# Altium schematic sheet Sheet2.SchDoc
size A4
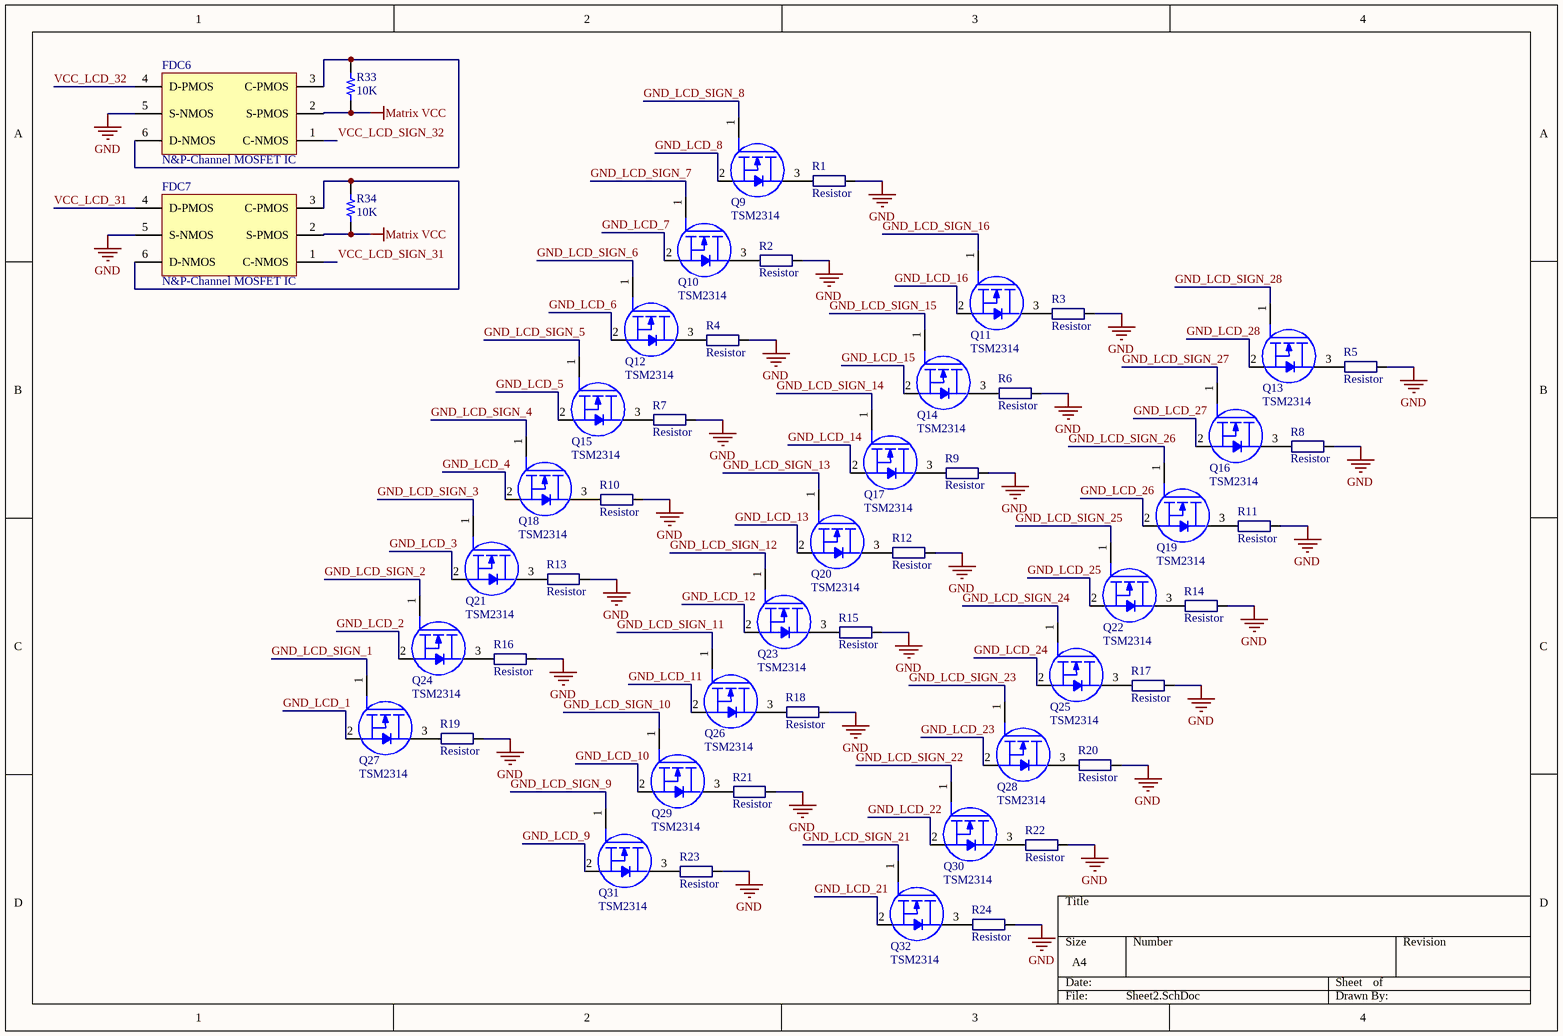
[diagram p0: Sheet2.SchDoc]

## Parts
FDC6  N&P-Channel MOSFET IC  [SSOT-6]
FDC7  N&P-Channel MOSFET IC  [SSOT-6]
Q9  TSM2314  [SOT95P280X130-3N]
Q10  TSM2314  [SOT95P280X130-3N]
Q11  TSM2314  [SOT95P280X130-3N]
Q12  TSM2314  [SOT95P280X130-3N]
Q13  TSM2314  [SOT95P280X130-3N]
Q14  TSM2314  [SOT95P280X130-3N]
Q15  TSM2314  [SOT95P280X130-3N]
Q16  TSM2314  [SOT95P280X130-3N]
Q17  TSM2314  [SOT95P280X130-3N]
Q18  TSM2314  [SOT95P280X130-3N]
Q19  TSM2314  [SOT95P280X130-3N]
Q20  TSM2314  [SOT95P280X130-3N]
Q21  TSM2314  [SOT95P280X130-3N]
Q22  TSM2314  [SOT95P280X130-3N]
Q23  TSM2314  [SOT95P280X130-3N]
Q24  TSM2314  [SOT95P280X130-3N]
Q25  TSM2314  [SOT95P280X130-3N]
Q26  TSM2314  [SOT95P280X130-3N]
Q27  TSM2314  [SOT95P280X130-3N]
Q28  TSM2314  [SOT95P280X130-3N]
Q29  TSM2314  [SOT95P280X130-3N]
Q30  TSM2314  [SOT95P280X130-3N]
Q31  TSM2314  [SOT95P280X130-3N]
Q32  TSM2314  [SOT95P280X130-3N]
R1  Resistor  [RESC0603(1608)_N]
R2  Resistor  [RESC0603(1608)_N]
R3  Resistor  [RESC0603(1608)_N]
R4  Resistor  [RESC0603(1608)_N]
R5  Resistor  [RESC0603(1608)_N]
R6  Resistor  [RESC0603(1608)_N]
R7  Resistor  [RESC0603(1608)_N]
R8  Resistor  [RESC0603(1608)_N]
R9  Resistor  [RESC0603(1608)_N]
R10  Resistor  [RESC0603(1608)_N]
R11  Resistor  [RESC0603(1608)_N]
R12  Resistor  [RESC0603(1608)_N]
R13  Resistor  [RESC0603(1608)_N]
R14  Resistor  [RESC0603(1608)_N]
R15  Resistor  [RESC0603(1608)_N]
R16  Resistor  [RESC0603(1608)_N]
R17  Resistor  [RESC0603(1608)_N]
R18  Resistor  [RESC0603(1608)_N]
R19  Resistor  [RESC0603(1608)_N]
R20  Resistor  [RESC0603(1608)_N]
R21  Resistor  [RESC0603(1608)_N]
R22  Resistor  [RESC0603(1608)_N]
R23  Resistor  [RESC0603(1608)_N]
R24  Resistor  [RESC0603(1608)_N]
R33  10K  [RES 0603/1608]
R34  10K  [RES 0603/1608]

## Nets
GND: FDC6.5(S-NMOS) FDC7.5(S-NMOS) R1.2 R2.2 R3.2 R4.2 R5.2 R6.2 R7.2 R8.2 R9.2 R10.2 R11.2 R12.2 R13.2 R14.2 R15.2 R16.2 R17.2 R18.2 R19.2 R20.2 R21.2 R22.2 R23.2 R24.2
Matrix VCC: FDC6.2(S-PMOS) FDC7.2(S-PMOS) R33.1 R34.1
GND_LCD_1: Q27.2(Source)
GND_LCD_2: Q24.2(Source)
GND_LCD_3: Q21.2(Source)
GND_LCD_4: Q18.2(Source)
GND_LCD_5: Q15.2(Source)
GND_LCD_6: Q12.2(Source)
GND_LCD_7: Q10.2(Source)
GND_LCD_8: Q9.2(Source)
GND_LCD_9: Q31.2(Source)
GND_LCD_10: Q29.2(Source)
GND_LCD_11: Q26.2(Source)
GND_LCD_12: Q23.2(Source)
GND_LCD_13: Q20.2(Source)
GND_LCD_14: Q17.2(Source)
GND_LCD_15: Q14.2(Source)
GND_LCD_16: Q11.2(Source)
GND_LCD_21: Q32.2(Source)
GND_LCD_22: Q30.2(Source)
GND_LCD_23: Q28.2(Source)
GND_LCD_24: Q25.2(Source)
GND_LCD_25: Q22.2(Source)
GND_LCD_26: Q19.2(Source)
GND_LCD_27: Q16.2(Source)
GND_LCD_28: Q13.2(Source)
GND_LCD_SIGN_1: Q27.1(Gate)
GND_LCD_SIGN_2: Q24.1(Gate)
GND_LCD_SIGN_3: Q21.1(Gate)
GND_LCD_SIGN_4: Q18.1(Gate)
GND_LCD_SIGN_5: Q15.1(Gate)
GND_LCD_SIGN_6: Q12.1(Gate)
GND_LCD_SIGN_7: Q10.1(Gate)
GND_LCD_SIGN_8: Q9.1(Gate)
GND_LCD_SIGN_9: Q31.1(Gate)
GND_LCD_SIGN_10: Q29.1(Gate)
GND_LCD_SIGN_11: Q26.1(Gate)
GND_LCD_SIGN_12: Q23.1(Gate)
GND_LCD_SIGN_13: Q20.1(Gate)
GND_LCD_SIGN_14: Q17.1(Gate)
GND_LCD_SIGN_15: Q14.1(Gate)
GND_LCD_SIGN_16: Q11.1(Gate)
GND_LCD_SIGN_21: Q32.1(Gate)
GND_LCD_SIGN_22: Q30.1(Gate)
GND_LCD_SIGN_23: Q28.1(Gate)
GND_LCD_SIGN_24: Q25.1(Gate)
GND_LCD_SIGN_25: Q22.1(Gate)
GND_LCD_SIGN_26: Q19.1(Gate)
GND_LCD_SIGN_27: Q16.1(Gate)
GND_LCD_SIGN_28: Q13.1(Gate)
VCC_LCD_31: FDC7.4(D-PMOS)
VCC_LCD_32: FDC6.4(D-PMOS)
VCC_LCD_SIGN_31: FDC7.1(C-NMOS)
VCC_LCD_SIGN_32: FDC6.1(C-NMOS)
NetFDC6_3: FDC6.3(C-PMOS) FDC6.6(D-NMOS) R33.2
NetFDC7_3: FDC7.3(C-PMOS) FDC7.6(D-NMOS) R34.2
NetQ9_3: Q9.3(Drain) R1.1
NetQ10_3: Q10.3(Drain) R2.1
NetQ11_3: Q11.3(Drain) R3.1
NetQ12_3: Q12.3(Drain) R4.1
NetQ13_3: Q13.3(Drain) R5.1
NetQ14_3: Q14.3(Drain) R6.1
NetQ15_3: Q15.3(Drain) R7.1
NetQ16_3: Q16.3(Drain) R8.1
NetQ17_3: Q17.3(Drain) R9.1
NetQ18_3: Q18.3(Drain) R10.1
NetQ19_3: Q19.3(Drain) R11.1
NetQ20_3: Q20.3(Drain) R12.1
NetQ21_3: Q21.3(Drain) R13.1
NetQ22_3: Q22.3(Drain) R14.1
NetQ23_3: Q23.3(Drain) R15.1
NetQ24_3: Q24.3(Drain) R16.1
NetQ25_3: Q25.3(Drain) R17.1
NetQ26_3: Q26.3(Drain) R18.1
NetQ27_3: Q27.3(Drain) R19.1
NetQ28_3: Q28.3(Drain) R20.1
NetQ29_3: Q29.3(Drain) R21.1
NetQ30_3: Q30.3(Drain) R22.1
NetQ31_3: Q31.3(Drain) R23.1
NetQ32_3: Q32.3(Drain) R24.1

## Library data of the parts
FDC6 FDC7 = FDC633C: Schematic: http://www.mouser.com/ds/2/149/FDC6333C-1007236.pdf; Package: SSOT-8
Q9-Q32 = 2389: N-Channel MOSFET; id: 2389; pakke_opprettet_av: 774; pakke_opprettet: 11.07.2014 23.17.33; symbol_opprettet: 11.07.2014 23.17.04; leverandor_varenr: 1864589; pris: -1; produsent: Taiwan Semiconductor; leverandor: Farnell; pakketype: SOT; symbol_opprettet_av: 774; navn: TSM2314; nokkelord: mosfet
R1-R8 = Resistor: Value: 46R
R9-R24 = Resistor: Value: 24R
R33 R34 = ERJ-3EKF2320V: RES SMD 232 OHM 1% 1/10W 0603; Value: 10K; Part Number: ERJ-3EKF2320V